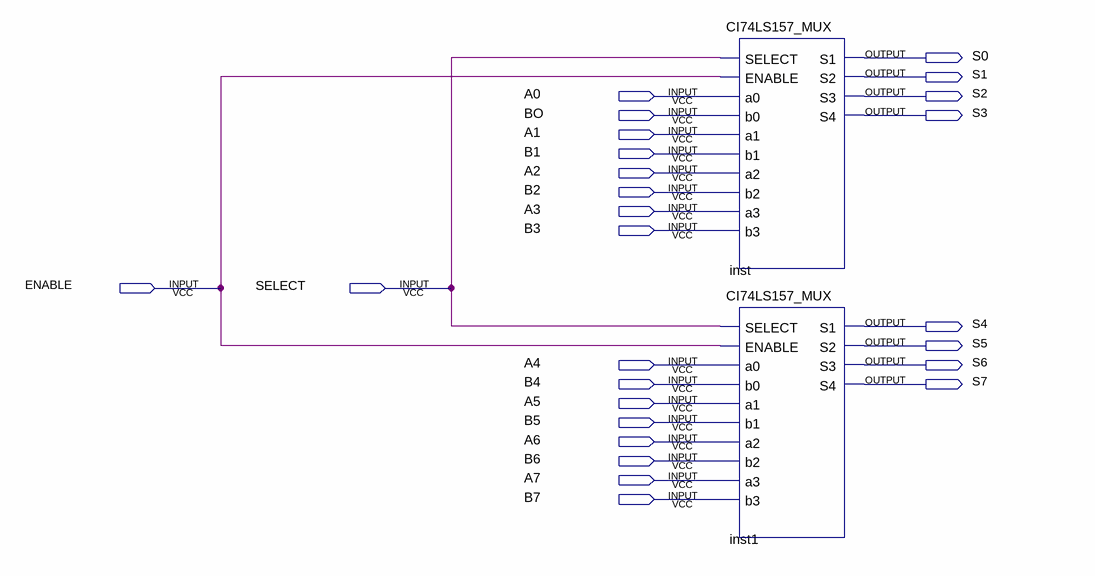
[diagram p0: schematic sheet]
// Quartus schematic MUX_OCTA_8BITS.bdf as structural Verilog: 2 symbols, 26 pins
module MUX_OCTA_8BITS (
  input  A0,
  input  BO,
  input  A1,
  input  B1,
  input  A2,
  input  B2,
  input  A3,
  input  B3,
  input  ENABLE,
  input  SELECT,
  input  A4,
  input  B4,
  input  A5,
  input  B5,
  input  A6,
  input  B6,
  input  A7,
  input  B7,
  output S0,
  output S1,
  output S2,
  output S3,
  output S4,
  output S5,
  output S6,
  output S7
);

  CI74LS157_MUX inst (
    .SELECT(SELECT), .ENABLE(ENABLE), .a0(A0), .b0(BO), .a1(A1), .b1(B1), .a2(A2), .b2(B2), .a3(A3), .b3(B3),
    .S1(S0), .S2(S1), .S3(S2), .S4(S3));
  CI74LS157_MUX inst1 (
    .SELECT(SELECT), .ENABLE(ENABLE), .a0(A4), .b0(B4), .a1(A5), .b1(B5), .a2(A6), .b2(B6), .a3(A7), .b3(B7),
    .S1(S4), .S2(S5), .S3(S6), .S4(S7));
endmodule
